# Altium schematic sheet DB10011_CANConnector.SchDoc: CAN Connectors
size A4; Engineer: Danny Bokma; Revision: V0.3; SheetNumber: 7; SheetTotal: 7
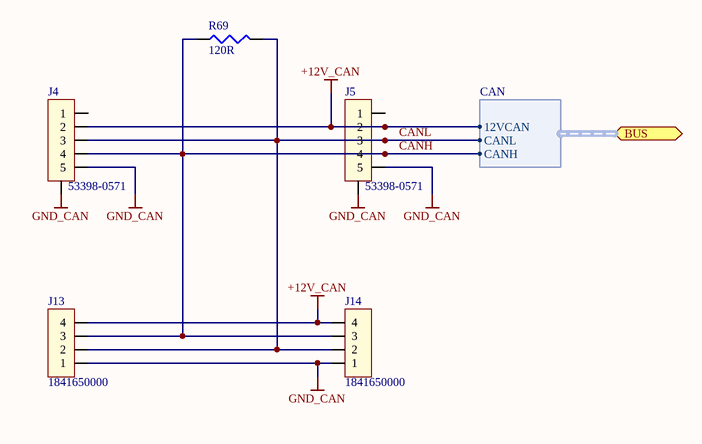
[diagram p0: DB10011_CANConnector.SchDoc]

## Parts
J4  53398-0571  [53398-0571]
J5  53398-0571  [53398-0571]
J13  1841650000  [1841650000]
J14  1841650000  [1841650000]
R69  120R  [0805]

## Ports
BUS (harness CAN)

## Harnesses
CAN: 12VCAN, CANL, CANH

## Nets
+12V_CAN: J4.2 J5.2 J13.4 J14.4 ; port BUS.12VCAN
GND_CAN: J4.0(SHLD) J4.5 J5.0(SHLD) J5.5 J13.1 J14.1
CANH: J4.4 J5.4 J13.3 J14.3 R69.2 ; port BUS.CANH
CANL: J4.3 J5.3 J13.2 J14.2 R69.1 ; port BUS.CANL

Not connected (* = marked no-connect by the designer): J4 1; J5 1

## Notes on the sheet
- Title
- Size:
- Date:
- A4
- Number:
- Time:
- Revision:
- Sheet
- of
- File:

## Library data of the parts
J4 J5 = 53398-0571: PicoBlade 53398 Series, 5Pin, Right Angle; Brand: MOLEX; Pitch: 1.25mm; Brand Number: 53398-0571; Case Style: 53398-0571; Order Code Supplier: 1125354; Price: 1,55; Supplier: Farnell
J13 J14 = 1841650000: SL-SMT Header, 3.5 mm, 4 Ways, 15 A, 320 V; Brand: Weidmuller; Pitch: 3.5mm; Brand Number: 1841650000; Case Style: SL-SMT; Order Code Supplier: 2077078; Price: 6.77; Supplier: Farnell
R69 = 0/0805/0100W/150V: Resistor, 0R, 0.1%, 0.1W, 150V, 200PPM, 0805; Brand: MULTICOMP; Brand Number: MC 0.1W 0805 0R; Case Style: 0805; Order Code Supplier: 9333681; Power Rating: 0.1W; Price: 0,038; Resistance: 0R; Supplier: Farnell; Temperature Coefficient: ± 200PPM; Temperature Range: -55°C to +125°C; Voltage Rating: 150V